# EasyEDA schematic SCH_esp32-4g-gateway_2026-08-06.json
TITLE: Sheet_1; REV: 1.0; Date: 2024-02-28; Sheet: 1/1; Drawn By: Jeeva Kandasamy; Company: Your Company
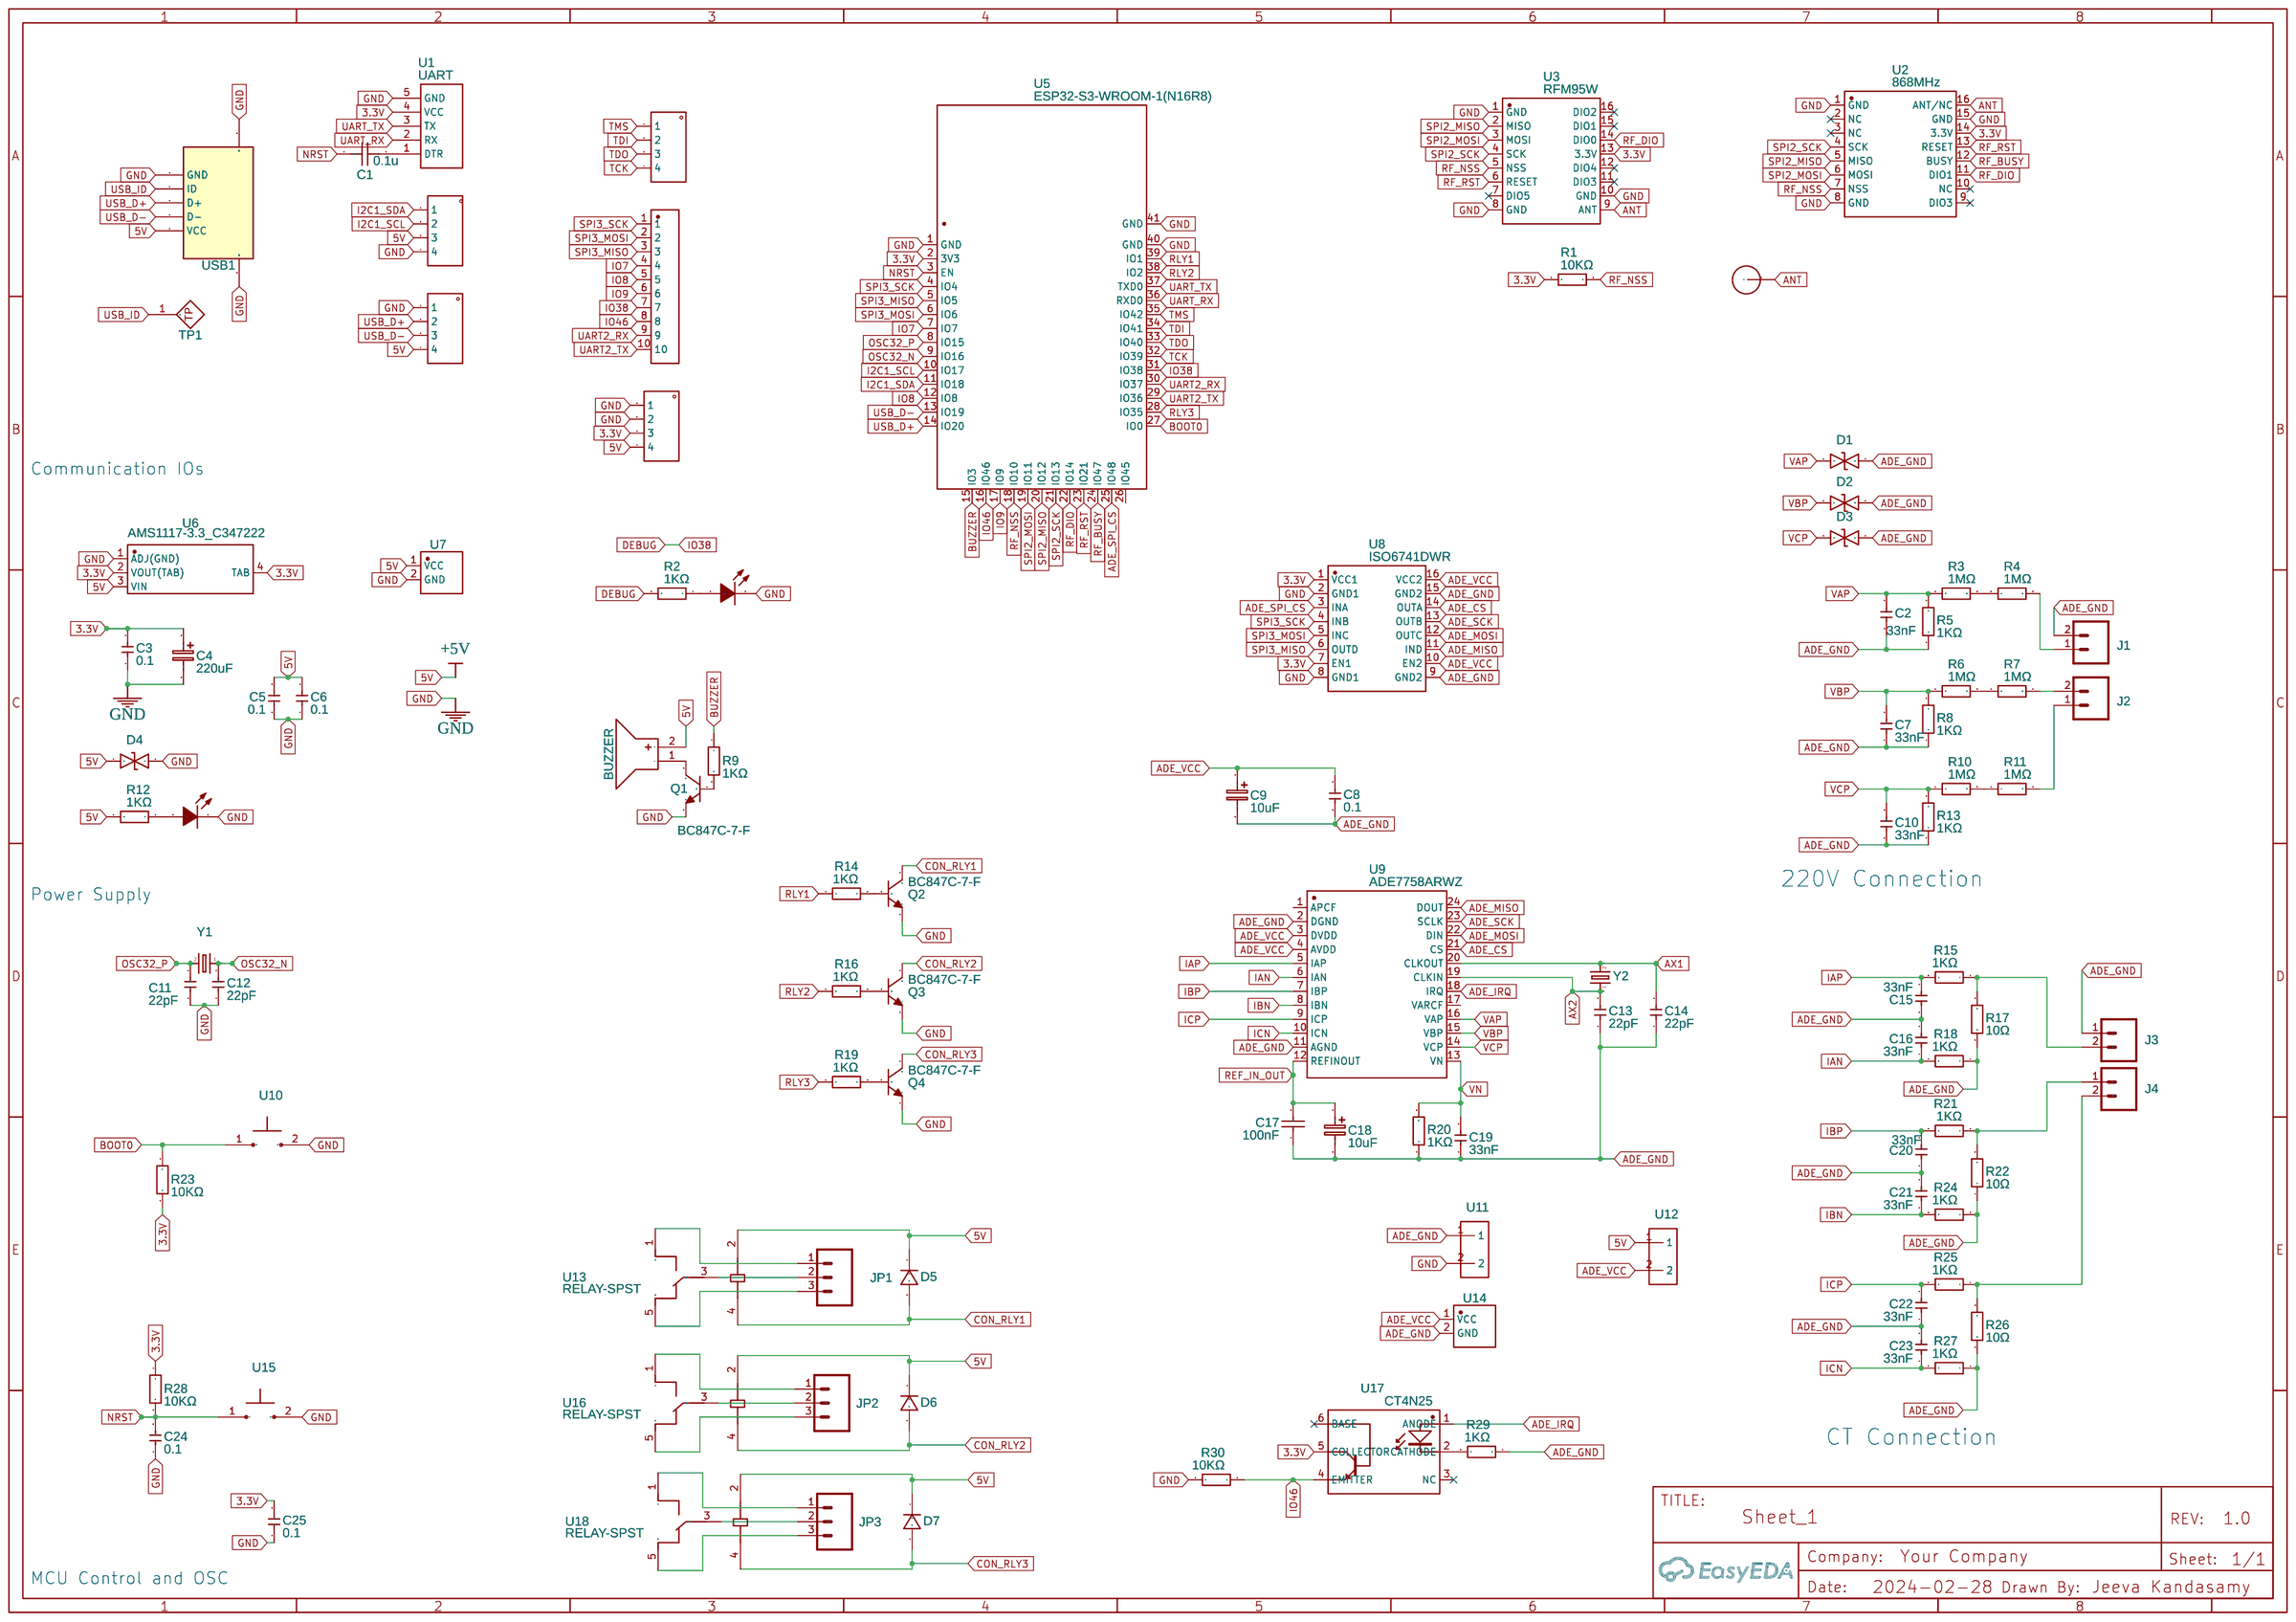
[diagram p0: schematic sheet]

## Parts
ANT1  RFM12B_ANTENNA  [RFM12B-ANTENNA]
BUZZER  BUZZER  [BUZ-TH_BD12.0-P6.00-D0.9-RD]
C1  0.1u  [C0603]
C2  33nF  [C0603]
C3  0.1  [C0603]
C4  220uF  [MY 10UF CAPACITOR]
C5  0.1  [C0603]
C6  0.1  [C0603]
C7  33nF  [C0603]
C8  0.1  [C0603]
C9  10uF  [MY 10UF CAPACITOR]
C10  33nF  [C0603]
C11  22pF  [C0603]
C12  22pF  [C0603]
C13  22pF  [C0603]
C14  22pF  [C0603]
C15  33nF  [C0603]
C16  33nF  [C0603]
C17  100nF  [C0603]
C18  10uF  [MY 10UF CAPACITOR]
C19  33nF  [C0603]
C20  33nF  [C0603]
C21  33nF  [C0603]
C22  33nF  [C0603]
C23  33nF  [C0603]
C24  0.1  [C0603]
C25  0.1  [C0603]
CN1  PINHEADER-4PIN  [PINHEADER-4PIN]
CN2  PINHEADER-4PIN  [PINHEADER-4PIN]
CN3  PINHEADER-4PIN  [PINHEADER-4PIN]
CN4  PINHEADER-4PIN  [PINHEADER-4PIN]
D1  P4SMA6.8CA_C139527  [SMA_L4.4-W2.6-LS5.0-BI]
D2  P4SMA6.8CA_C139527  [SMA_L4.4-W2.6-LS5.0-BI]
D3  P4SMA6.8CA_C139527  [SMA_L4.4-W2.6-LS5.0-BI]
D4  P4SMA6.8CA_C139527  [SMA_L4.4-W2.6-LS5.0-BI]
D5  1N4007GU  [1N4007]
D6  1N4007GU  [1N4007]
D7  1N4007GU  [1N4007]
DEBUG  3ARB9HCB  [LED-3MM]
J1  M02-SCREW-5MM  [SCREWTERMINAL-5MM-2]
J2  M02-SCREW-5MM  [SCREWTERMINAL-5MM-2]
J3  M02-SCREW-5MM  [SCREWTERMINAL-5MM-2]
J4  M02-SCREW-5MM  [SCREWTERMINAL-5MM-2]
JP1  M03-SCREW-5MM  [SCREWTERMINAL-5MM-3]
JP2  M03-SCREW-5MM  [SCREWTERMINAL-5MM-3]
JP3  M03-SCREW-5MM  [SCREWTERMINAL-5MM-3]
POWER  3ARB9HCB  [LED-3MM]
Q1  BC847C-7-F  [SOT-23-3_L2.9-W1.3-P1.90-LS2.4-BR]
Q2  BC847C-7-F  [SOT-23-3_L2.9-W1.3-P1.90-LS2.4-BR]
Q3  BC847C-7-F  [SOT-23-3_L2.9-W1.3-P1.90-LS2.4-BR]
Q4  BC847C-7-F  [SOT-23-3_L2.9-W1.3-P1.90-LS2.4-BR]
R1  10KΩ  [R0603]
R2  1KΩ  [R0603]
R3  1MΩ  [R0603]
R4  1MΩ  [R0603]
R5  1KΩ  [R0603]
R6  1MΩ  [R0603]
R7  1MΩ  [R0603]
R8  1KΩ  [R0603]
R9  1KΩ  [R0603]
R10  1MΩ  [R0603]
R11  1MΩ  [R0603]
R12  1KΩ  [R0603]
R13  1KΩ  [R0603]
R14  1KΩ  [R0603]
R15  1KΩ  [R0603]
R16  1KΩ  [R0603]
R17  10Ω  [R0603]
R18  1KΩ  [R0603]
R19  1KΩ  [R0603]
R20  1KΩ  [R0603]
R21  1KΩ  [R0603]
R22  10Ω  [R0603]
R23  10KΩ  [R0603]
R24  1KΩ  [R0603]
R25  1KΩ  [R0603]
R26  10Ω  [R0603]
R27  1KΩ  [R0603]
R28  10KΩ  [R0603]
R29  1KΩ  [R0603]
R30  10KΩ  [R0603]
TP1  Test Point  [1-POINT_TEST-POINT]
U1  UART  [UART-HDR-5X1/2.54]
U2  868MHz  [WIRELM-SMD_DL-LLCC68-S]
U3  RFM95W  [COMM-SMD_RFM95W]
U4  Pin Header 1x10Pin 2.54mm 10P  [PIN HEADER 1X10PIN 2.54MM 10P]
U5  ESP32-S3-WROOM-1(N16R8)  [WIRELM-SMD_ESP32-S3-WROOM-1]
U6  AMS1117-3.3_C347222  [SOT-223-4_L6.5-W3.5-P2.30-LS7.0-BR]
U7  2 Pin Header  [2PINHEADER]
U8  ISO6741DWR  [SOIC-16_L10.3-W7.5-P1.27-LS10.3-BL]
U9  ADE7758ARWZ  [SOIC-24]
U10  SMD Tactile Switch 3x6x2.5  [SMD TACTILE SWITCH 3X6X2.5]
U11  Jumper - 5MM  [JUMPER - 5MM]
U12  Jumper - 5MM  [JUMPER - 5MM]
U13  RELAY-SPST  [RELAY-TH_RELAY-SPST]
U14  2 Pin Header  [2PINHEADER]
U15  SMD Tactile Switch 3x6x2.5  [SMD TACTILE SWITCH 3X6X2.5]
U16  RELAY-SPST  [RELAY-TH_RELAY-SPST]
U17  CT4N25  [DIP-6_L7.1-W6.5-P2.54-LS7.6-BL]
U18  RELAY-SPST  [RELAY-TH_RELAY-SPST]
USB1  U-F-M5SW-Y-3  [MICRO-USB-SMD_MICRO-USB-16]
Y1  CRYSTAL 10MHz  [32.768KHZ]
Y2  CRYSTAL 10MHz  [HC49US]

## Library data of the parts
ANT1 = RFM12B_ANTENNA: Contributor: ardugeek
BUZZER = BUZZER: Contributor: lcsc; Supplier: LCSC; Supplier Part: C9900014030; Manufacturer: null; Manufacturer Part: buzzer; JLCPCB Part Class: Extended Part; link: https://lcsc.com/eda_search?q=C9900014030&%26type=1&ref=editor
C1 = C_0603_US: Contributor: LCEDA_Lib
C2 C7 C10 C15 C16 C19-C23 = -: SMD CAP Ceramic 33nF-50V-10%-X7R;0603; catid: 20; Supplier: SeeedStudio; Manufacturer Part: CC0603KRX7R9BB333; Supplier Part: 302010088
C3 C5 C6 C8 C11-C14 C24 C25 = -: SMD CAP Ceramic 22pF-50V-5%-NPO; catid: 20; Supplier: SeeedStudio; Manufacturer Part: CC0603JRNPO9BN220; Supplier Part: 302010143
C4 C9 C18 = My 10uF Capator: Contributor: Mingos; Manufacturer Part: JORGE TOURIS COMPANY; Supplier: Farnell
C17 = -: Voltage: 50V; Tolerance: ±10%; Supplier: EasyEDA; Manufacturer: FH; Manufacturer Part: 0603B104K500NT; Supplier Part: E30926
CN1-CN4 = PINHEADER-4PIN: Contributor: Kamil Kowieski
D1-D4 = P4SMA6.8CA_C139527: Contributor: LCSC; Supplier: LCSC; Supplier Part: C139527; Manufacturer: Yenji Elec; Manufacturer Part: P4SMA6.8CA
D5-D7 = 1N4007GU: Supplier: LCSC; Supplier Part: C189226; Manufacturer: DIYI Elec Tech; Contributor: LCSC; JLCPCB Part Class: Extended Part
DEBUG POWER = 3ARB9HCB: Supplier: LCSC; Manufacturer: KENTO; Supplier Part: C42016; link: https://lcsc.com/eda_search?q=C42016&%26type=1&ref=editor
J1-J4 = M02-SCREW-5MM: Contributor: James Kennewell
JP1-JP3 = M03-SCREW-5MM: Contributor: Dmitry Shestakov
Q1-Q4 = BC847C-7-F: Contributor: LCSC; Supplier: LCSC; Supplier Part: C177010; Manufacturer: DIODES(美台); JLCPCB Part Class: Extended Part
R1 R2 R5 R8 R9 R12-R16 R18-R21 R23-R25 R27-R30 = -: Power: 1/10W; Tolerance: ±1%; Supplier: EasyEDA; Manufacturer: UniOhm; Manufacturer Part: 0603WAF1001T5E; Supplier Part: E21190
R3 R4 R6 R7 R10 R11 = -: Power: 1/10W; Tolerance: ±1%; Supplier: EasyEDA; Manufacturer: UniOhm; Manufacturer Part: 0603WAF1004T5E; Supplier Part: E22935
R17 R22 R26 = -: Power: 1/10W; Tolerance: ±1%; Supplier: EasyEDA; Manufacturer: UniOhm; Manufacturer Part: 0603WAF100JT5E; Supplier Part: E22859
TP1 = Test Point: Contributor: Gabriel Kucera
U1 = Arduino-UART: Manufacturer Part: CP2102 UART; Contributor: vkbs
U2 = DL-LLCC68-S-868: Contributor: lcsc; Supplier: LCSC; Supplier Part: C2894790; Manufacturer: DreamLNK(骏晔科技); JLCPCB Part Class: Extended Part
U3 = RFM95W: Contributor: LCSC; Supplier: LCSC; Supplier Part: C9900000484; JLCPCB Part Class: Extended Part; Manufacturer: null
U4 = Pin Header 1x10Pin 2.54mm 10P: Contributor: FirstZ Kai Zen
U5 = ESP32-S3-WROOM-1(N16R8): Contributor: lcsc; Supplier: LCSC; Supplier Part: C2913202; Manufacturer: ESPRESSIF(乐鑫); Manufacturer Part: ESP32-S3-WROOM-1-N16R8; JLCPCB Part Class: Extended Part
U6 = AMS1117-3.3_C347222: Supplier: LCSC; Supplier Part: C347222; Manufacturer: Youtai Semiconductor Co., Ltd.; Manufacturer Part: AMS1117-3.3; Contributor: LCSC; JLCPCB Part Class: Extended Part
U7 U14 = 2 Pin Header: Contributor: August L.
U8 = ISO6741DWR: Contributor: LCSC; Supplier: LCSC; Supplier Part: C9900000005; JLCPCB Part Class: Extended Part
U9 = -: Manufacturer Part: ?
U10 U15 = SMD Tactile Switch 3x6x2.5: Contributor: rio711phil_5603
U11 U12 = Jumper - 5MM: Supplier Part: undefined; Contributor: joeduderey
U13 U16 U18 = RELAY-SPST: Supplier: LCSC; Supplier Part: C2941249; Manufacturer: null; Manufacturer Part: Relay-SPST; JLCPCB Part Class: Extended Part; Contributor: skygen
U17 = CT4N25: Contributor: LCSC; Supplier: LCSC; Supplier Part: C191858; Manufacturer: CT MICRO; Manufacturer Part: 4N25; JLCPCB Part Class: Extended Part
USB1 = U-F-M5SW-Y-3: Supplier: LCSC; Manufacturer: 韩国韩荣; Supplier Part: C106820; JLCPCB Part Class: Extended Part; link: https://lcsc.com/eda_search?q=C106820&%26type=1&ref=editor
Y1 Y2 = -: catid: 20; Contributor: SparkFun; Manufacturer Part: ?

## Nets
3.3V: C3.2 C4.1 C25.2 CN4.3 R1.2 R23.2 R28.1 U1.4(VCC) U2.14(3.3V) U3.13(3.3V) U5.2(3V3) U6.2(VOUT(TAB)) U6.4(TAB) U8.1(VCC1) U8.7(EN1) U17.5(COLLECTOR)
+5V: BUZZER.2(+) C5.2 C6.2 CN2.3 CN3.4 CN4.4 D4.2 D5.1 D6.1 D7.1 R12.2 U6.3(VIN) U7.1(VCC) U12.1 U13.2 U16.2 U18.2 USB1.1(VCC)
GND: C3.1 C4.2 C5.1 C6.1 C11.1 C12.1 C24.1 C25.1 CN2.4 CN3.1 CN4.1 CN4.2 D4.1 DEBUG.2(K) POWER.2(K) Q1.2(E) Q2.2(E) Q3.2(E) Q4.2(E) R30.2 U1.5(GND) U2.1(GND) U2.8(GND) U2.15(GND) U3.1(GND) U3.8(GND) U3.10(GND) U5.1(GND) U5.40(GND) U5.41(GND) U6.1(ADJ(GND)) U7.2(GND) U8.2(GND1) U8.8(GND1) U10.2 U11.2 U15.2 USB1.0(SHLD) USB1.5(GND)
ADE_CS: U8.14(OUTA) U9.21(CS)
ADE_GND: C2.1 C7.1 C8.1 C9.2 C10.1 C13.1 C14.1 C15.2 C16.2 C17.1 C18.2 C19.1 C20.1 C21.2 C22.1 C23.2 D1.1 D2.1 D3.1 J1.2 J3.1 R5.1 R8.1 R13.1 R17.1 R18.1 R20.1 R22.1 R24.1 R26.1 R27.1 R29.1 U8.9(GND2) U8.15(GND2) U9.2(DGND) U9.11(AGND) U11.1 U14.2(GND)
ADE_IRQ: U9.18(IRQ) U17.1(ANODE)
ADE_MISO: U8.11(IND) U9.24(DOUT)
ADE_MOSI: U8.12(OUTC) U9.22(DIN)
ADE_SCK: U8.13(OUTB) U9.23(SCLK)
ADE_SPI_CS: U5.25(IO48) U8.3(INA)
ADE_VCC: C8.2 C9.1 U8.10(EN2) U8.16(VCC2) U9.3(DVDD) U9.4(AVDD) U12.2 U14.1(VCC)
ANT: ANT1.P$1(1) U2.16(ANT/NC) U3.9(ANT)
AX1: C14.2 U9.20(CLKOUT) Y2.2
AX2: C13.2 U9.19(CLKIN) Y2.1
BOOT0: R23.1 U5.27(IO0) U10.1
BUZZER: R9.1 U5.15(IO3)
CON_RLY1: D5.2 Q2.3(C) U13.4
CON_RLY2: D6.2 Q3.3(C) U16.4
CON_RLY3: D7.2 Q4.3(C) U18.4
DEBUG: R2.2 U4.7 U5.31(IO38)
I2C1_SCL: CN2.2 U5.10(IO17)
I2C1_SDA: CN2.1 U5.11(IO18)
IAN: C16.1 R18.2 U9.6(IAN)
IAP: C15.1 R15.2 U9.5(IAP)
IBN: C21.1 R24.2 U9.8(IBN)
IBP: C20.2 R21.2 U9.7(IBP)
ICN: C23.1 R27.2 U9.10(ICN)
ICP: C22.2 R25.2 U9.9(ICP)
IO7: U4.4 U5.7(IO7)
IO8: U4.5 U5.12(IO8)
IO9: U4.6 U5.17(IO9)
IO46: R30.1 U4.8 U5.16(IO46) U17.4(EMITTER)
NRST: C1.1 C24.2 R28.2 U5.3(EN) U15.1
OSC32_N: C12.2 U5.9(IO16) Y1.1
OSC32_P: C11.2 U5.8(IO15) Y1.2
REF_IN_OUT: C17.2 C18.1 U9.12(REFINOUT)
RF_BUSY: U2.12(BUSY) U5.24(IO47)
RF_DIO: U2.11(DIO1) U3.14(DIO0) U5.22(IO14)
RF_NSS: R1.1 U2.7(NSS) U3.5(NSS) U5.18(IO10)
RF_RST: U2.13(RESET) U3.6(RESET) U5.23(IO21)
RLY1: R14.1 U5.39(IO1)
RLY2: R16.1 U5.38(IO2)
RLY3: R19.1 U5.28(IO35)
SPI2_MISO: U2.5(MISO) U3.2(MISO) U5.20(IO12)
SPI2_MOSI: U2.6(MOSI) U3.3(MOSI) U5.19(IO11)
SPI2_SCK: U2.4(SCK) U3.4(SCK) U5.21(IO13)
SPI3_MISO: U4.3 U5.5(IO5) U8.6(OUTD)
SPI3_MOSI: U4.2 U5.6(IO6) U8.5(INC)
SPI3_SCK: U4.1 U5.4(IO4) U8.4(INB)
TCK: CN1.4 U5.32(IO39)
TDI: CN1.2 U5.34(IO41)
TDO: CN1.3 U5.33(IO40)
TMS: CN1.1 U5.35(IO42)
UART2_RX: U4.9 U5.30(IO37)
UART2_TX: U4.10 U5.29(IO36)
UART_RX: U1.2(RX) U5.36(RXD0)
UART_TX: U1.3(TX) U5.37(TXD0)
USB_D+: CN3.2 U5.14(IO20) USB1.3(D+)
USB_D-: CN3.3 U5.13(IO19) USB1.2(D-)
USB_ID: TP1.1 USB1.4(ID)
VAP: C2.2 D1.2 R3.1 R5.2 U9.16(VAP)
VBP: C7.2 D2.2 R6.1 R8.2 U9.15(VBP)
VCP: C10.2 D3.2 R10.1 R13.2 U9.14(VCP)
VN: C19.2 R20.2 U9.13(VN)
Net-(BUZZER-1): BUZZER.1(-) Q1.3(C)
Net-(C1-2): C1.2 U1.1(DTR)
Net-(DEBUG-1): DEBUG.1(A) R2.1
Net-(J1-1): J1.1 R4.2
Net-(J2-1): J2.1 R11.2
Net-(J2-2): J2.2 R7.2
Net-(J3-2): J3.2 R15.1 R17.2
Net-(J4-1): J4.1 R21.1 R22.2
Net-(J4-2): J4.2 R25.1 R26.2
Net-(JP1-1): JP1.1 U13.1
Net-(JP1-2): JP1.2 U13.3
Net-(JP1-3): JP1.3 U13.5
Net-(JP2-1): JP2.1 U16.1
Net-(JP2-2): JP2.2 U16.3
Net-(JP2-3): JP2.3 U16.5
Net-(JP3-1): JP3.1 U18.1
Net-(JP3-2): JP3.2 U18.3
Net-(JP3-3): JP3.3 U18.5
Net-(POWER-1): POWER.1(A) R12.1
Net-(Q1-1): Q1.1(B) R9.2
Net-(Q2-1): Q2.1(B) R14.2
Net-(Q3-1): Q3.1(B) R16.2
Net-(Q4-1): Q4.1(B) R19.2
Net-(R3-2): R3.2 R4.1
Net-(R6-2): R6.2 R7.1
Net-(R10-2): R10.2 R11.1
Net-(R29-2): R29.2 U17.2(CATHODE)

Not connected (* = marked no-connect by the designer): U2 2(NC)* 3(NC)* 9(DIO3)* 10(NC)*; U3 7(DIO5)* 11(DIO3)* 12(DIO4)* 15(DIO1)* 16(DIO2)*; U5 26(IO45); U9 1(APCF) 17(VARCF); U17 3(NC)* 6(BASE)*

## Notes on the sheet
- Communication IOs
- 220V Connection
- Power Supply
- CT Connection
- MCU Control and OSC
